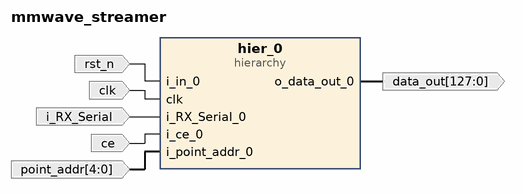
[diagram p0: block diagram of the top level]
# Vivado block design mmwave_streamer, xczu3eg-sbva484-1-i, Vivado 2020.2
create_bd_design mmwave_streamer

create_bd_port -dir I rst_n
create_bd_port -dir I i_RX_Serial
create_bd_port -dir I -type clk clk
create_bd_port -dir I ce
create_bd_port -dir O -from 127 -to 0 data_out
create_bd_port -dir I -from 4 -to 0 point_addr

create_bd_cell -type hier hier_0

# ---- hierarchy /hier_0 ----
current_bd_instance /hier_0
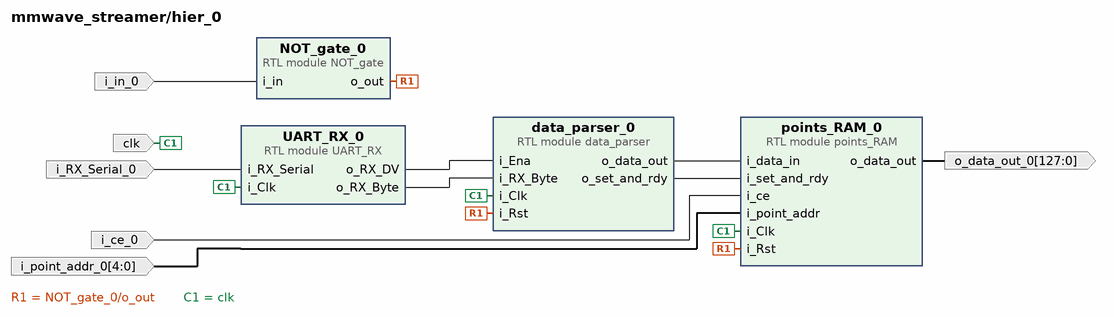
[diagram p1: block diagram inside /hier_0]
create_bd_pin -dir I i_in_0
create_bd_pin -dir I -type clk clk
create_bd_pin -dir I i_RX_Serial_0
create_bd_pin -dir I i_ce_0
create_bd_pin -dir O -from 127 -to 0 o_data_out_0
create_bd_pin -dir I -from 4 -to 0 i_point_addr_0

create_bd_cell -type module -reference NOT_gate NOT_gate_0
create_bd_cell -type module -reference points_RAM points_RAM_0
create_bd_cell -type module -reference UART_RX UART_RX_0
create_bd_cell -type module -reference data_parser data_parser_0

# ---- connections ----

current_bd_instance /hier_0
connect_bd_net [get_bd_pins NOT_gate_0/o_out] [get_bd_pins points_RAM_0/i_Rst] [get_bd_pins data_parser_0/i_Rst]
connect_bd_net [get_bd_pins data_parser_0/o_data_out] [get_bd_pins points_RAM_0/i_data_in]
connect_bd_net [get_bd_pins data_parser_0/o_set_and_rdy] [get_bd_pins points_RAM_0/i_set_and_rdy]
connect_bd_net [get_bd_pins UART_RX_0/o_RX_DV] [get_bd_pins data_parser_0/i_Ena]
connect_bd_net [get_bd_pins UART_RX_0/o_RX_Byte] [get_bd_pins data_parser_0/i_RX_Byte]
connect_bd_net -net i_in_0_1 [get_bd_pins i_in_0] [get_bd_pins NOT_gate_0/i_in]
connect_bd_net -net clk_0_1 [get_bd_pins clk] [get_bd_pins UART_RX_0/i_Clk] [get_bd_pins data_parser_0/i_Clk] [get_bd_pins points_RAM_0/i_Clk]
connect_bd_net -net i_RX_Serial_0_1 [get_bd_pins i_RX_Serial_0] [get_bd_pins UART_RX_0/i_RX_Serial]
connect_bd_net -net i_ce_0_1 [get_bd_pins i_ce_0] [get_bd_pins points_RAM_0/i_ce]
connect_bd_net [get_bd_pins points_RAM_0/o_data_out] [get_bd_pins o_data_out_0]
connect_bd_net -net i_point_addr_0_1 [get_bd_pins i_point_addr_0] [get_bd_pins points_RAM_0/i_point_addr]

current_bd_instance /
connect_bd_net -net i_in_0_1 [get_bd_ports rst_n] [get_bd_pins hier_0/i_in_0]
connect_bd_net -net clk_0_1 [get_bd_ports clk] [get_bd_pins hier_0/clk]
connect_bd_net -net i_RX_Serial_0_1 [get_bd_ports i_RX_Serial] [get_bd_pins hier_0/i_RX_Serial_0]
connect_bd_net -net i_ce_0_1 [get_bd_ports ce] [get_bd_pins hier_0/i_ce_0]
connect_bd_net [get_bd_pins hier_0/o_data_out_0] [get_bd_ports data_out]
connect_bd_net -net i_point_addr_0_1 [get_bd_ports point_addr] [get_bd_pins hier_0/i_point_addr_0]

validate_bd_design
save_bd_design
